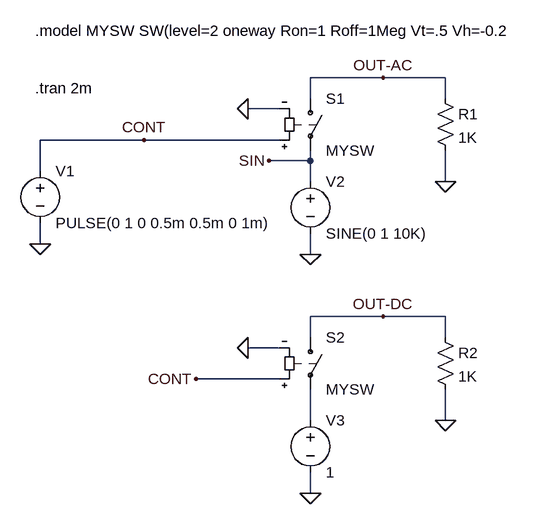
[diagram p0: schematic Fig_2-112_Vswitch_Level2_Oneway-AC-DC_1.asc]
Fig_2-112_Vswitch_Level2_Oneway-AC-DC_1.asc, the LTspice schematic file:
Version 4
SHEET 1 880 724
WIRE 320 64 208 64
WIRE 416 64 320 64
WIRE 208 96 208 64
WIRE 416 96 416 64
WIRE 160 112 112 112
WIRE -48 160 -208 160
WIRE 160 160 -48 160
WIRE 208 192 208 176
WIRE 208 192 144 192
WIRE -208 208 -208 160
WIRE 208 224 208 192
WIRE 416 224 416 176
WIRE -208 320 -208 288
WIRE 208 336 208 304
WIRE 320 432 208 432
WIRE 416 432 320 432
WIRE 208 464 208 432
WIRE 416 464 416 432
WIRE 160 480 112 480
WIRE 160 528 32 528
WIRE 208 592 208 544
WIRE 416 592 416 544
WIRE 208 704 208 672
FLAG 112 112 0
FLAG 416 224 0
FLAG 208 336 0
FLAG -208 320 0
FLAG 320 64 OUT-AC
FLAG -48 160 CONT
FLAG 112 480 0
FLAG 416 592 0
FLAG 208 704 0
FLAG 320 432 OUT-DC
FLAG 32 528 CONT
FLAG 144 192 SIN
SYMBOL sw 208 80 R0
SYMATTR InstName S1
SYMATTR Value MYSW
SYMBOL voltage 208 208 R0
WINDOW 123 0 0 Left 2
WINDOW 39 0 0 Left 2
SYMATTR InstName V2
SYMATTR Value SINE(0 1 10K)
SYMBOL voltage -208 192 R0
WINDOW 123 0 0 Left 2
WINDOW 39 0 0 Left 2
SYMATTR InstName V1
SYMATTR Value PULSE(0 1 0 0.5m 0.5m 0 1m)
SYMBOL res 400 80 R0
SYMATTR InstName R1
SYMATTR Value 1K
SYMBOL sw 208 448 R0
SYMATTR InstName S2
SYMATTR Value MYSW
SYMBOL voltage 208 576 R0
WINDOW 123 0 0 Left 2
WINDOW 39 0 0 Left 2
SYMATTR InstName V3
SYMATTR Value 1
SYMBOL res 400 448 R0
SYMATTR InstName R2
SYMATTR Value 1K
TEXT -216 -8 Left 2 !.model MYSW SW(level=2 oneway Ron=1 Roff=1Meg Vt=.5 Vh=-0.2
TEXT -216 80 Left 2 !.tran 2m

The netlist it stands for:
* Fig_2-112_Vswitch_Level2_Oneway-AC-DC_1.asc
S1 OUT-AC SIN CONT 0 MYSW
V2 SIN 0 SINE(0 1 10K)
V1 CONT 0 PULSE(0 1 0 0.5m 0.5m 0 1m)
R1 OUT-AC 0 1K
S2 OUT-DC N001 CONT 0 MYSW
V3 N001 0 1
R2 OUT-DC 0 1K
.model MYSW SW(level=2 oneway Ron=1 Roff=1Meg Vt=.5 Vh=-0.2
.tran 2m
.backanno
.end